# Altium schematic sheet CLRC663Design.SchDoc: CLRC663 Schematic
size A3; Date: October 13th, 2015; Author: Nathan Lea; Revision: 1.0
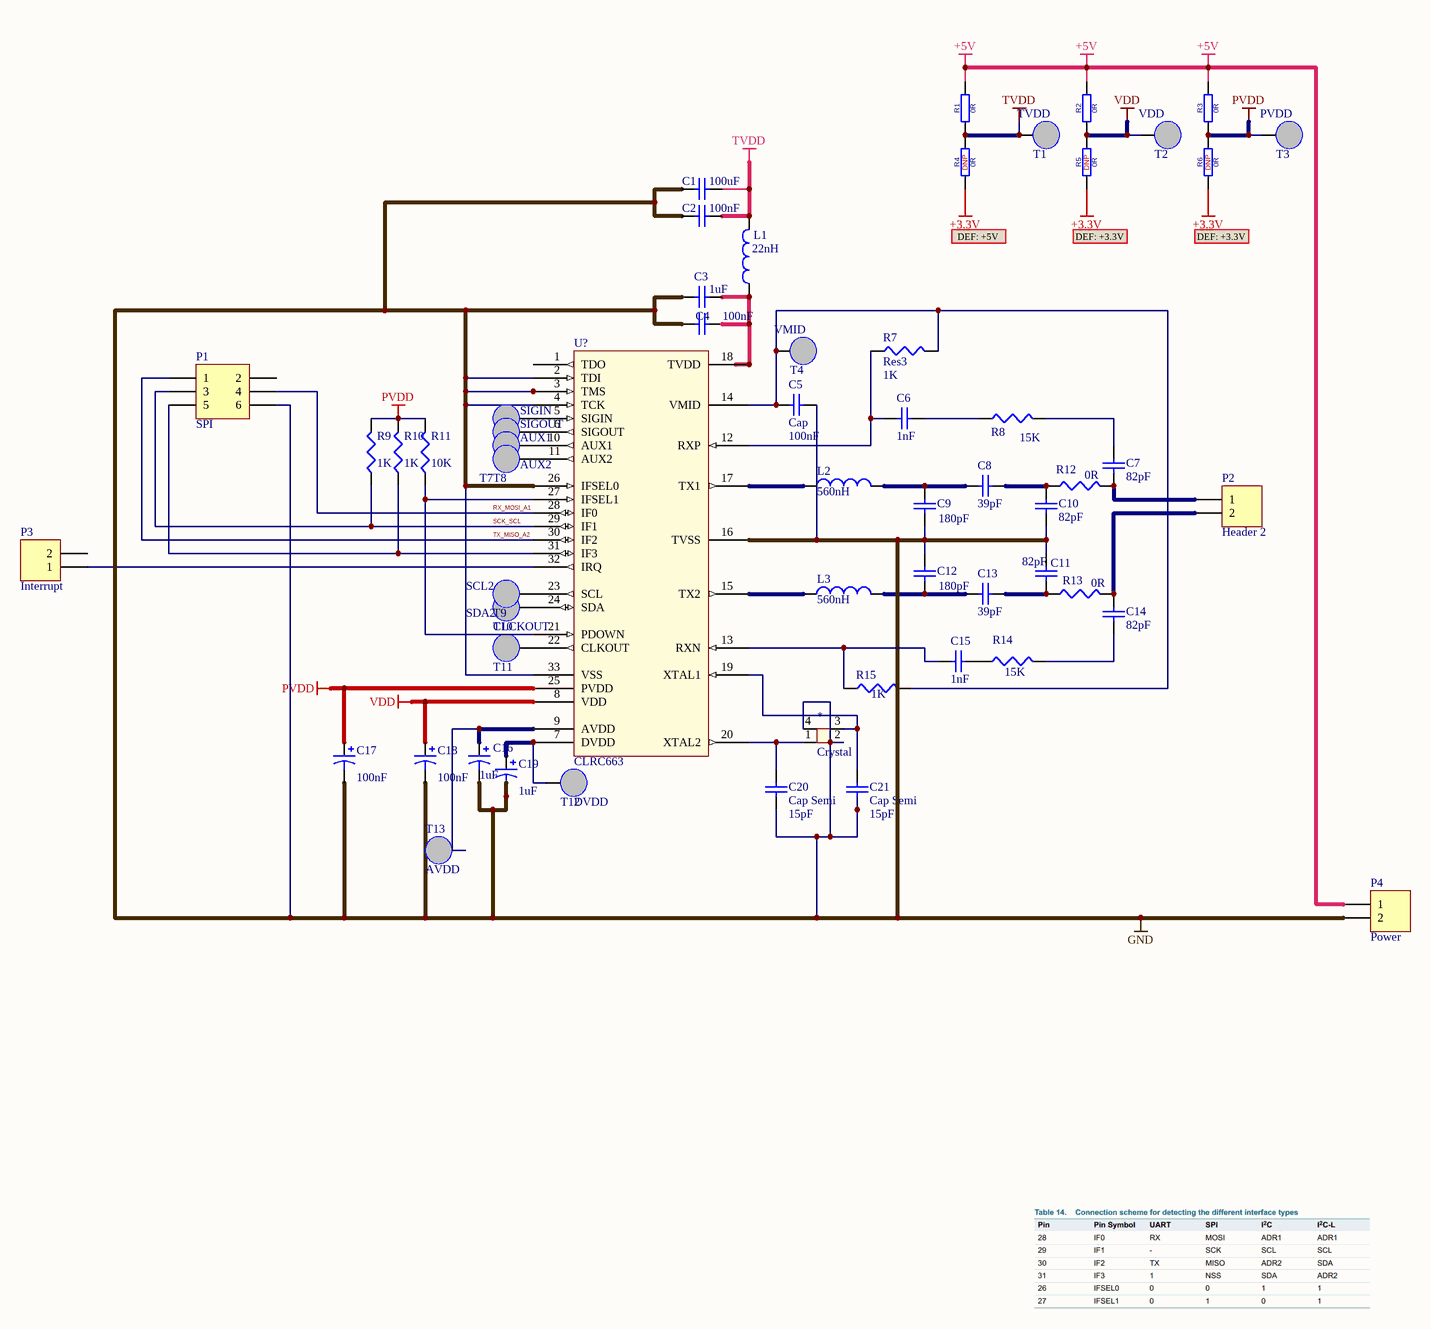
[diagram p0: CLRC663Design.SchDoc]

## Parts
*  Crystal  [DFN220P355X80-4N]
C1  value 100uF  [C1206]  (hidden comment: Cap)
C2  value 100nF  [6-0805_N]  (hidden comment: Cap)
C3  value 1uF  [6-0805_N]  (hidden comment: Cap)
C4  value 100nF  [6-0805_N]  (hidden comment: Cap)
C5  Cap  value 100nF  [6-0805_N]
C6  value 1nF  [6-0805_N]  (hidden comment: Cap)
C7  value 82pF  [6-0805_N]  (hidden comment: Cap)
C8  value 39pF  [6-0805_N]  (hidden comment: Cap)
C9  value 180pF  [6-0805_N]  (hidden comment: Cap)
C10  value 82pF  [6-0805_N]  (hidden comment: Cap)
C11  value 82pF  [6-0805_N]  (hidden comment: Cap)
C12  value 180pF  [6-0805_N]  (hidden comment: Cap)
C13  value 39pF  [6-0805_N]  (hidden comment: Cap)
C14  value 82pF  [6-0805_N]  (hidden comment: Cap)
C15  value 1nF  [6-0805_N]  (hidden comment: Cap)
C16  value 1uF  [C0805]  (hidden comment: Cap Pol3)
C17  value 100nF  [C0805]  (hidden comment: Cap Pol3)
C18  value 100nF  [C0805]  (hidden comment: Cap Pol3)
C19  value 1uF  [C0805]  (hidden comment: Cap Pol3)
C20  Cap Semi  value 15pF  [1608[0603]]
C21  Cap Semi  value 15pF  [1608[0603]]
L1  value 22nH  [INDC4532]  (hidden comment: Inductor)
L2  value 560nH  [6-0805_L]  (hidden comment: Inductor)
L3  value 560nH  [6-0805_L]  (hidden comment: Inductor)
P1  SPI  [HDR2X3]
P2  Header 2  [HDR1X2]
P3  Interrupt  [HDR1X2]
P4  Power  [HDR1X2]
R1  value 0R  [6-0805_N]  (hidden comment: 0R DNP)
R2  value 0R  [6-0805_N]  (hidden comment: 0R DNP)
R3  value 0R  [6-0805_N]  (hidden comment: 0R DNP)
R4  value 0R  [6-0805_N]  (hidden comment: 0R DNP)
R5  0R  [6-0805_N]
R6  0R  [6-0805_N]
R7  Res3  value 1K  [6-0805_N]
R8  value 15K  [6-0805_N]  (hidden comment: Res3)
R9  value 1K  [6-0805_N]  (hidden comment: Res3)
R10  value 1K  [6-0805_N]  (hidden comment: Res3)
R11  value 10K  [6-0805_N]  (hidden comment: Res3)
R12  value 0R  [6-0805_N]  (hidden comment: Res3)
R13  value 0R  [6-0805_N]  (hidden comment: Res3)
R14  value 15K  [6-0805_N]  (hidden comment: Res3)
R15  value 1K  [6-0805_N]  (hidden comment: Res3)
T1  TVDD  [PCBComponent_1]
T2  VDD  [PCBComponent_1]
T3  PVDD  [PCBComponent_1]
T4  VMID  [PCBComponent_1]
T5  SIGIN  [PCBComponent_1]
T6  SIGOUT  [PCBComponent_1]
T7  AUX1  [PCBComponent_1]
T8  AUX2  [PCBComponent_1]
T9  SCL2  [PCBComponent_1]
T10  SDA2  [PCBComponent_1]
T11  CLCKOUT  [PCBComponent_1]
T12  DVDD  [PCBComponent_1]
T13  AVDD  [PCBComponent_1]
U?  CLRC663  [QFN50P500X500X100_HS-33N]

## Nets
+3.3V: R4.1 R5.1 R6.1
+5V: P4.1 R1.2 R2.2 R3.2
GND: *.2 *.4 C1.2 C2.2 C3.2 C4.2 C5.2 C9.1 C10.2 C11.1 C12.2 C16.2 C17.2 C18.2 C19.2 C20.1 C21.1 P1.6 P4.2 U?.2(TDI) U?.3(TMS) U?.4(TCK) U?.16(TVSS) U?.26(IFSEL0) U?.33(VSS)
PVDD: C17.1 R3.1 R6.2 R9.2 R10.2 R11.2 T3.1 U?.25(PVDD)
TVDD: C1.1 C2.1 L1.2 R1.1 R4.2 T1.1
VDD: C18.1 R2.1 R5.2 T2.1 U?.8(VDD)
RX_MOSI_A1: P1.4 U?.28(IF0)
SCK_SCL: P1.3 R9.1 U?.29(IF1)
TX_MISO_A2: P1.1 U?.30(IF2)
Net*_1: *.1 C20.2 U?.20(XTAL2)
Net*_3: *.3 C21.2 U?.19(XTAL1)
NetC3_1: C3.1 C4.1 L1.1 U?.18(TVDD)
NetC5_1: C5.1 R7.2 R15.2 T4.1 U?.14(VMID)
NetC6_1: C6.1 R8.1
NetC6_2: C6.2 R7.1 U?.12(RXP)
NetC7_1: C7.1 R8.2
NetC7_2: C7.2 P2.1 R12.2
NetC8_1: C8.1 C10.1 R12.1
NetC8_2: C8.2 C9.2 L2.2
NetC11_2: C11.2 C13.1 R13.1
NetC12_1: C12.1 C13.2 L3.2
NetC14_1: C14.1 P2.2 R13.2
NetC14_2: C14.2 R14.2
NetC15_1: C15.1 R14.1
NetC15_2: C15.2 R15.1 U?.13(RXN)
NetC16_1: C16.1 T13.1 U?.9(AVDD)
NetC19_1: C19.1 T12.1 U?.7(DVDD)
NetL2_1: L2.1 U?.17(TX1)
NetL3_1: L3.1 U?.15(TX2)
NetP1_5: P1.5 R10.1 U?.31(IF3)
NetP3_1: P3.1 U?.32(IRQ)
NetR11_1: R11.1 U?.21(PDOWN) U?.27(IFSEL1)
NetT5_1: T5.1 U?.5(SIGIN)
NetT6_1: T6.1 U?.6(SIGOUT)
NetT7_1: T7.1 U?.10(AUX1)
NetT8_1: T8.1 U?.11(AUX2)
NetT9_1: T9.1 U?.23(SCL)
NetT10_1: T10.1 U?.24(SDA)
NetT11_1: T11.1 U?.22(CLKOUT)

Not connected (* = marked no-connect by the designer): P1 2; P3 2; U? 1(TDO)

## Notes on the sheet
- DEF: +5V
- DEF: +3.3V

## Library data of the parts
* = Component_1
C1-C15 = Cap: Capacitor; Published: 8-Jun-2000; LatestRevisionDate: 17-Jul-2002; LatestRevisionNote: Re-released for DXP Platform.; PackageReference: RAD-0.3; Publisher: Altium Limited; PackageDescription: Radial Cap, Thru-Hole; 2 Leads; 0.3 in Pin Spacing
C16-C19 = Cap Pol3: Polarized Capacitor (Surface Mount); Published: 8-Jun-2000; LatestRevisionDate: 29-May-2009; LatestRevisionNote: IPC-7351 Footprint Added.; PackageReference: C0805; Publisher: Altium Limited; PackageDescription: Chip Capacitor
C20 C21 = Cap Semi: Capacitor (Semiconductor SIM Model); Published: 8-Jun-2000; LatestRevisionDate: 29-May-2009; LatestRevisionNote: IPC-7351 Footprint Added.; PackageReference: C1206; Publisher: Altium Limited; PackageDescription: Chip Capacitor
L1-L3 = Inductor: Code_IEC: 1005; Published: 8-Jun-2000; LatestRevisionDate: 29-May-2009; LatestRevisionNote: IPC-7351 Footprint Added.; PackageReference: 0402-A; Publisher: Altium Limited; PackageDescription: Chip Inductor; Code_JEITA: 0402
P1 = Header 3X2: Header, 3-Pin, Dual row; LatestRevisionDate: 17-Jul-2002; LatestRevisionNote: Re-released for DXP Platform.; Publisher: Altium Limited
P2-P4 = Header 2: Header, 2-Pin; LatestRevisionDate: 17-Jul-2002; LatestRevisionNote: Re-released for DXP Platform.; Publisher: Altium Limited
R1-R6 = RESC0805
  R2-R4: DNP: DNP
  R5 R6: Value: 0R; DNP: DNP
R7-R15 = Res3: Resistor; Published: 8-Jun-2000; LatestRevisionDate: 29-May-2009; LatestRevisionNote: IPC-7351 Footprint Added.; PackageReference: J1-0603; Publisher: Altium Limited; PackageDescription: Chip Resistor
T1-T13 = Testpoint